# Altium schematic sheet RS485.SchDoc
size 209 x 297 mm; Address1: Address1; Address2: Address2; Address3: Address3; Address4: Address4; DocumentNumber: АБВГ.123456.001 Э3; SheetNumber: 1; Scale: 1:1; DocumentType: Схема электрическая принципиальная; FirstReferrence: АБВГ.123456.001; Разраб.: Иванов; Обозначение документа: АБВГ.123456.001 Э3; Пров.: Петров; Утв.: Сидоров; Наименование организации: ОАО "Концерн "МПО-Гидроприбор"; Перв. применение: АБВГ.123456.000; Наименование изделия 1: Плата; Наименование изделия 2: Схема электрическая; Наименование изделия 3: принципиальная; Нач. отд.: Нач. отд.; Фамилия нач. отд.: Сидоров
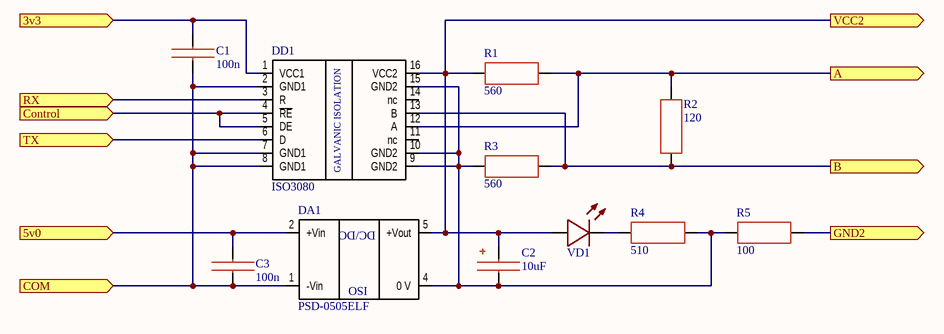
[diagram p0: RS485.SchDoc]

## Parts
C1  100n  [CC0805_3D]
C2  10uF  [Tantal Type C]
C3  100n  [CC0805_3D]
DA1  PSD-0505ELF  [PSD-xxxxELF]
DD1  ISO3080  [SO_16_W]
R1  560  [RC0805_3D]
R2  120  [RC0805_3D]
R3  560  [RC0805_3D]
R4  510  [RC0805_3D]
R5  100  [RC0805_3D]
VD1  Value  [2030]  (value not drawn)

## Ports
3v3 (in), 5v0 (in), A (out), B (out), COM (in), Control (in), GND2 (out), RX (in), TX (in), VCC2 (out)

## Nets
3v3: C1.2 DD1.1(VCC1) ; port 3v3
5v0: C3.2 DA1.2(+Vin) ; port 5v0
A: DD1.12(A) R1.2 R2.2 ; port A
B: DD1.13(B) R2.1 R3.2 ; port B
COM: C1.1 C3.1 DA1.1(-Vin) DD1.2(GND1) DD1.7(GND1) DD1.8(GND1) ; port COM
Control: DD1.4(~{RE}) DD1.5(DE) ; port Control
GND2: R5.2 ; port GND2
RX: DD1.3(R) ; port RX
TX: DD1.6(D) ; port TX
VCC2: C2.2 DA1.5(+Vout) DD1.16(VCC2) R1.1 VD1.2 ; port VCC2
NetC2_1: C2.1 DA1.4(0_V) DD1.9(GND2) DD1.10(GND2) DD1.15(GND2) R3.1 R4.1 R5.1
NetR4_2: R4.2 VD1.1

Not connected (* = marked no-connect by the designer): DA1 8(NC); DD1 11(nc) 14(nc)

## Notes on the sheet
- Перв. примен.
- Справ. №
- Подп. и дата
- Инв. № дубл.
- Взам. инв. №
- Инв. № подл.
- Изм.
- Лист
- № докум.
- Подп.
- Дата
- Копировал
- (in symbol ISO3080) GALVANIC ISOLATION
- (in symbol PSD-xxxxELF) DC/DC; ISO

## Library data of the parts
C1 C3 = CC0805 X uF: Value: 100n
C2 = Tantal C 10uF: 16 V; Value: 10uF; Voltage: 16 V
DA1 = PSD-xxxxELF: Value: PSD-0505ELF
R1-R5 = RC0805 X Ohm
  R1 R3: Value: 560
  R2: Value: 120
  R4: Value: 510
  R5: Value: 100
VD1 = KA-3021SGCT